# Altium schematic sheet ECEN215LabKit Communications.SchDoc
size A; SheetNumber: 1; SheetTotal: 10
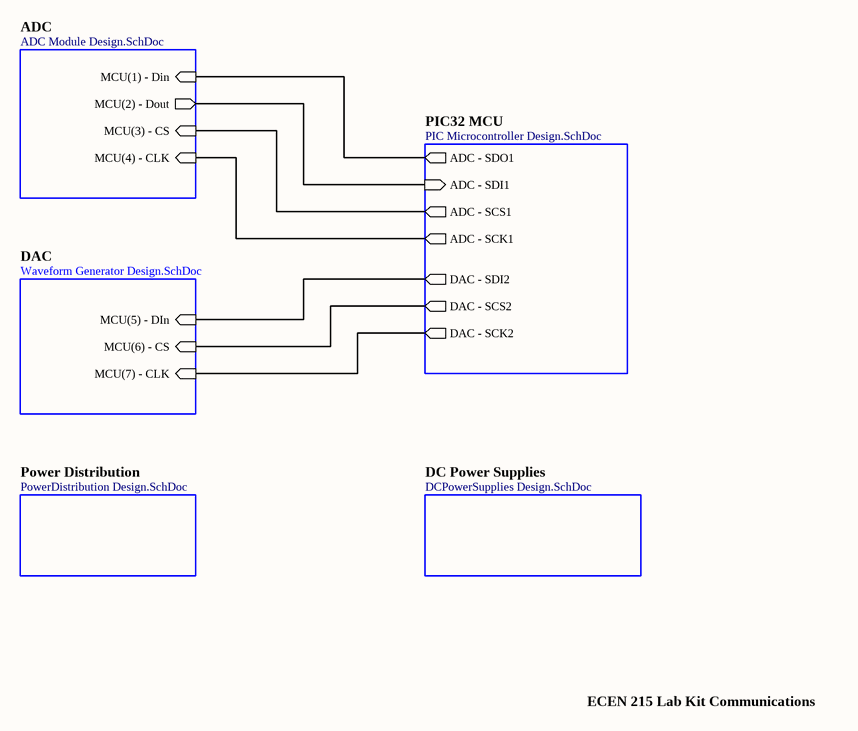
[diagram p0: ECEN215LabKit Communications.SchDoc]

## Sub-sheets
ADC = ADC Module Design.SchDoc: MCU(2) - Dout (out), MCU(4) - CLK (in), MCU(3) - CS (in), MCU(1) - Din (in)
DAC = Waveform Generator Design.SchDoc: MCU(5) - DIn (in), MCU(6) - CS (in), MCU(7) - CLK (in)
DC Power Supplies = DCPowerSupplies Design.SchDoc: no entries
PIC32 MCU = PIC Microcontroller Design.SchDoc: ADC - SCK1 (out), DAC - SCK2 (out), DAC - SDI2 (out), DAC - SCS2 (out), ADC - SCS1 (out), ADC - SDI1 (in), ADC - SDO1 (out)
Power Distribution = PowerDistribution Design.SchDoc: no entries

## Nets
(unnamed): sheet DAC/MCU(5) - DIn, sheet PIC32 MCU/DAC - SDI2
(unnamed): sheet DAC/MCU(6) - CS, sheet PIC32 MCU/DAC - SCS2
(unnamed): sheet DAC/MCU(7) - CLK, sheet PIC32 MCU/DAC - SCK2
(unnamed): sheet ADC/MCU(2) - Dout, sheet PIC32 MCU/ADC - SDI1
(unnamed): sheet ADC/MCU(4) - CLK, sheet PIC32 MCU/ADC - SCK1
(unnamed): sheet ADC/MCU(3) - CS, sheet PIC32 MCU/ADC - SCS1
(unnamed): sheet ADC/MCU(1) - Din, sheet PIC32 MCU/ADC - SDO1

## Notes on the sheet
- ECEN 215 Lab Kit Communications